# Altium schematic sheet PWR.SchDoc
size A4; SheetNumber: 7; SheetTotal: 7
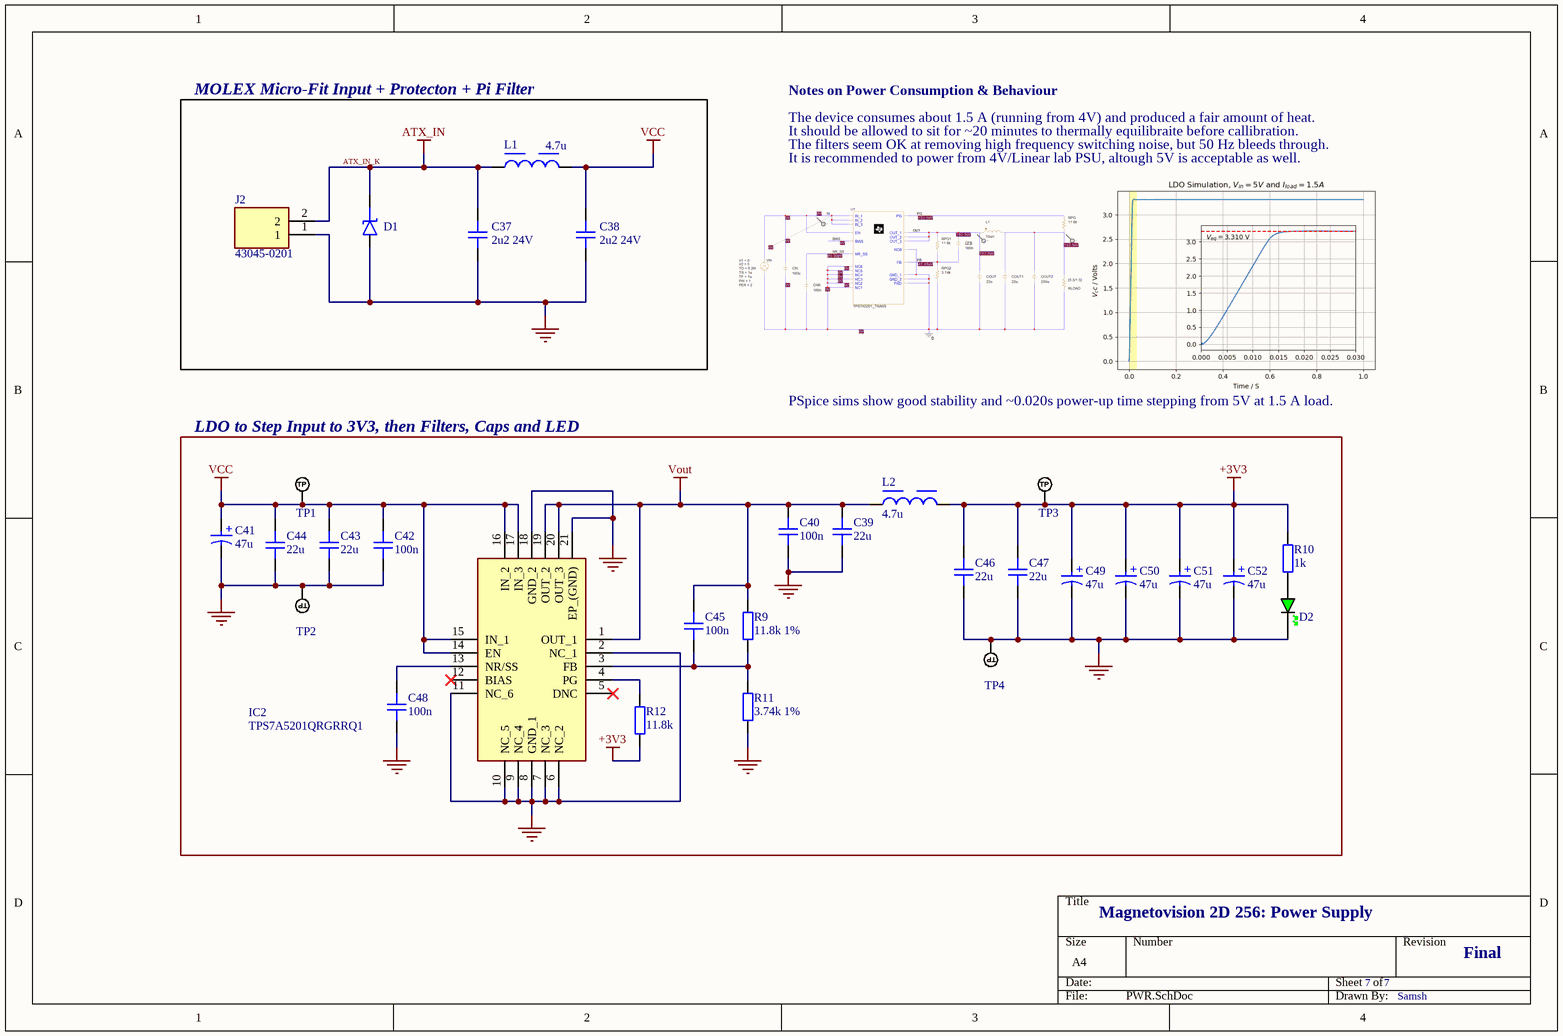
[diagram p0: PWR.SchDoc]

## Parts
C37  2u2 24V  [CAP_0805]
C38  2u2 24V  [CAP_0805]
C39  22u  [CAP_0805]
C40  100n  [CAP_0603]
C41  47u  [WCAP-ASLI_D6.3H5.5]
C42  100n  [CAP_0603]
C43  22u  [CAP_0805]
C44  22u  [CAP_0805]
C45  100n  [CAP_0603]
C46  22u  [CAP_0805]
C47  22u  [CAP_0805]
C48  100n  [CAP_0603]
C49  47u  [WCAP-ASLI_D6.3H5.5]
C50  47u  [WCAP-ASLI_D6.3H5.5]
C51  47u  [WCAP-ASLI_D6.3H5.5]
C52  47u  [WCAP-ASLI_D6.3H5.5]
D1  SMA Shottky  [DO-214AC-2 (SMA)]  (value not drawn)
D2  LED_0603_GREEN  [LED_0603_GREEN]  (value not drawn)
IC2  TPS7A5201QRGRRQ1  [QFN50P350X350X100-21N-D]
J2  43045-0201  [43045-02YY]
L1  4.7u  [WE-LHMI_7030]
L2  4.7u  [WE-LHMI_7030]
R9  11.8k 1%  [RES_0603]
R10  1k  [RES_0603]
R11  3.74k 1%  [RES_0603]
R12  11.8k  [RES_0603]
TP1  TEST_POINT_RND_1MM  [PAD_RND_1MM]  (value not drawn)  (no BOM)
TP2  TEST_POINT_RND_1MM  [PAD_RND_1MM]  (value not drawn)  (no BOM)
TP3  TEST_POINT_RND_1MM  [PAD_RND_1MM]  (value not drawn)  (no BOM)
TP4  TEST_POINT_RND_1MM  [PAD_RND_1MM]  (value not drawn)  (no BOM)

## Blocks framed on the sheet
MOLEX Micro-Fit Input + Protecton + Pi Filter: C37 C38 D1 J2 L1
LDO to Step Input to 3V3, then Filters, Caps and LED: C39-C52 D2 IC2 L2 R9-R12 TP1-TP4

## Nets
+3V3: C46.2 C47.2 C49.1(P) C50.1(P) C51.1(P) C52.1(P) L2.1 R10.2 R12.1 TP3.1(TP)
ATX_IN_K: C37.2 D1.K J2.2 L1.1  [also labelled ATX_IN]
GND: C37.1 C38.1 C39.1 C40.1 C41.2(N) C42.1 C43.1 C44.1 C46.1 C47.1 C48.1 C49.2(N) C50.2(N) C51.2(N) C52.2(N) D1.A D2.K IC2.2(NC_1) IC2.6(NC_2) IC2.7(NC_3) IC2.8(GND_1) IC2.9(NC_4) IC2.10(NC_5) IC2.11(NC_6) IC2.18(GND_2) IC2.21(EP_(GND)) J2.1 R11.1 TP2.1(TP) TP4.1(TP)
VCC: C38.2 C41.1(P) C42.2 C43.2 C44.2 IC2.14(EN) IC2.15(IN_1) IC2.16(IN_2) IC2.17(IN_3) L1.2 TP1.1(TP)
Vout: C39.2 C40.2 C45.2 IC2.1(OUT_1) IC2.19(OUT_2) IC2.20(OUT_3) L2.2 R9.2
NetC45_1: C45.1 IC2.3(FB) R9.1 R11.2
NetC48_2: C48.2 IC2.13(NR/SS)
NetD2_A: D2.A R10.1
NetIC2_4: IC2.4(PG) R12.2

Not connected (* = marked no-connect by the designer): IC2 5(DNC)* 12(BIAS)*

## Notes on the sheet
- Notes on Power Consumption & Behaviour
- The device consumes about 1.5 A (running from 4V) and produced a fair amount of heat.
- It should be allowed to sit for ~20 minutes to thermally equilibraite before callibration.
- The filters seem OK at removing high frequency switching noise, but 50 Hz bleeds through.
- It is recommended to power from 4V/Linear lab PSU, altough 5V is acceptable as well.
- PSpice sims show good stability and ~0.020s power-up time stepping from 5V at 1.5 A load.
- Magnetovision 2D 256: Power Supply
- 7
- Final
- Samsh
- (in symbol CMP-03913-53914608-1) +

## Library data of the parts
C37-C39 C43 C44 C46 C47 = CMP-001-00086-1: Capacitor SMD 0805; Source: Schematic-Lib-PhilsLab.SchLib; Rating: *; Manufacturer Part Number: *; Distributor Link: *; Design Item ID: CAP_0805; Manufacturer: *; LCSC: *; Dielectric: *
C40 C42 C45 C48 = CMP-001-00085-1: Capacitor SMD 0603; Distributor Link: *; LCSC: *; Design Item ID: CAP_0603; Rating: *; Source: Schematic-Lib-PhilsLab.SchLib; Manufacturer Part Number: *; Manufacturer: *; Dielectric: *
C41 C49-C52 = CMP-03913-53914608-1: 865080543009 Alum. Electrolytic Cap 47µF 35V 6.3mmV-Chip WCAP-ASLI; Lifetime 2000h +105°C; Life (Hours): 2000hours; Insulation Resistance: 2.12766MΩ; Ripple Current: 240mA; Impedance: 530mΩ; Leakage Current: 16.45µA; Tolerance: 20%; Polarity: Polar; ESR (Equivalent Series Resistance): 413.353mΩ; NexarPartId: 53914608; Case/Package: Radial; Capacitance: 47µF; Min Operating Temperature: -55°C; Voltage Rating: 35V; Diameter: 6.3mm; Width: 6.6mm; RoHS: Compliant; Ripple Current (AC): 240mA; Height: 5.5mm; Length: 5.5mm; Max Operating Temperature: 105°C; REACH SVHC: Unknown; Packaging: Tape & Reel (TR); Mount: Surface Mount; Voltage Rating (DC): 35V; Height - Seated (Max): 5.5118mm
D1 = CMP-004-00047-1: Diode Schottky SMD SMA (DO-214AA); Design Item ID: D_SCHOTTKY_SMA; Source: Schematic-Lib-PhilsLab.SchLib
D2 = CMP-004-00051-1: LED 0603 GREEN SMD; Source: Schematic-Lib-PhilsLab.SchLib; Design Item ID: LED_0603_GREEN
IC2 = TPS7A5201QRGRRQ1: Integrated Circuit; Manufacturer_Name: Texas Instruments; Datasheet Link: http://www.ti.com/lit/gpn/tps7a52-q1; Height: 1mm; Manufacturer_Part_Number: TPS7A5201QRGRRQ1; Mouser Part Number: 595-TPS7A5201QRGRRQ1; Mouser Price/Stock: https://www.mouser.co.uk/ProductDetail/Texas-Instruments/TPS7A5201QRGRRQ1?qs=1mbolxNpo8cdxsbFt%252By4TQ%3D%3D; Arrow Part Number: TPS7A5201QRGRRQ1; Arrow Price/Stock: https://www.arrow.com/en/products/tps7a5201qrgrrq1/texas-instruments
J2 = 43045-0201: Connector; Manufacturer_Name: Molex; Datasheet Link: https://www.molex.com/pdm_docs/sd/430450200_sd.pdf; Height: 9.9mm; Manufacturer_Part_Number: 43045-0201; Mouser Part Number: 538-43045-0201; Mouser Price/Stock: https://www.mouser.co.uk/ProductDetail/Molex/43045-0201?qs=R7%2FZKp6KZ2Y51sj1nic43g%3D%3D
L1 L2 = CMP-1353-00057-5: NexarPartId: 22866641; Current Rating: 3.8A; Inductance: 4.7µH; Shielding: Shielded; Frequency: 22MHz; Series Resistance: 40mΩ; Inductance Tolerance: 20%; Saturation Current: 7.5A; Test Frequency: 100kHz; Core Material: Composite, Ferrite; DC Resistance (DCR): 37mΩ; Case/Package: Nonstandard; Width: 6.6mm; Max Operating Temperature: 125°C; Min Operating Temperature: -40°C; Termination: SMD/SMT; Max DC Current: 3.8A; Ambient Temperature Range Low: -40°C; RMS Current (Irms): 3.8A; Height: 2.8mm; REACH SVHC: Unknown; Tolerance: 20%; Composition: Wirewound; Packaging: Tape & Reel (TR); Self Resonant Frequency: 22MHz; RoHS: Compliant; Mount: Surface Mount; Length: 7.3mm; Depth: 6.6mm; Height - Seated (Max): 3.0988mm; Ambient Temperature Range High: 85°C
R9-R12 = CMP-009-00179-1: Resistor SMD 0603; Manufacturer Part Number: *; Distributor Link: *; Source: Schematic-Lib-PhilsLab.SchLib; Manufacturer: *; Design Item ID: RES_0603; LCSC: *
TP1-TP4 = CMP-020-000001-1: Test Point Round 1mm (NO BOM); Design Item ID: TEST_POINT_RND_1MM; Source: Schematic-Lib-PhilsLab.SchLib